# Altium schematic sheet LCL_1.SchDoc
size A4; SheetNumber: 2; SheetTotal: 5
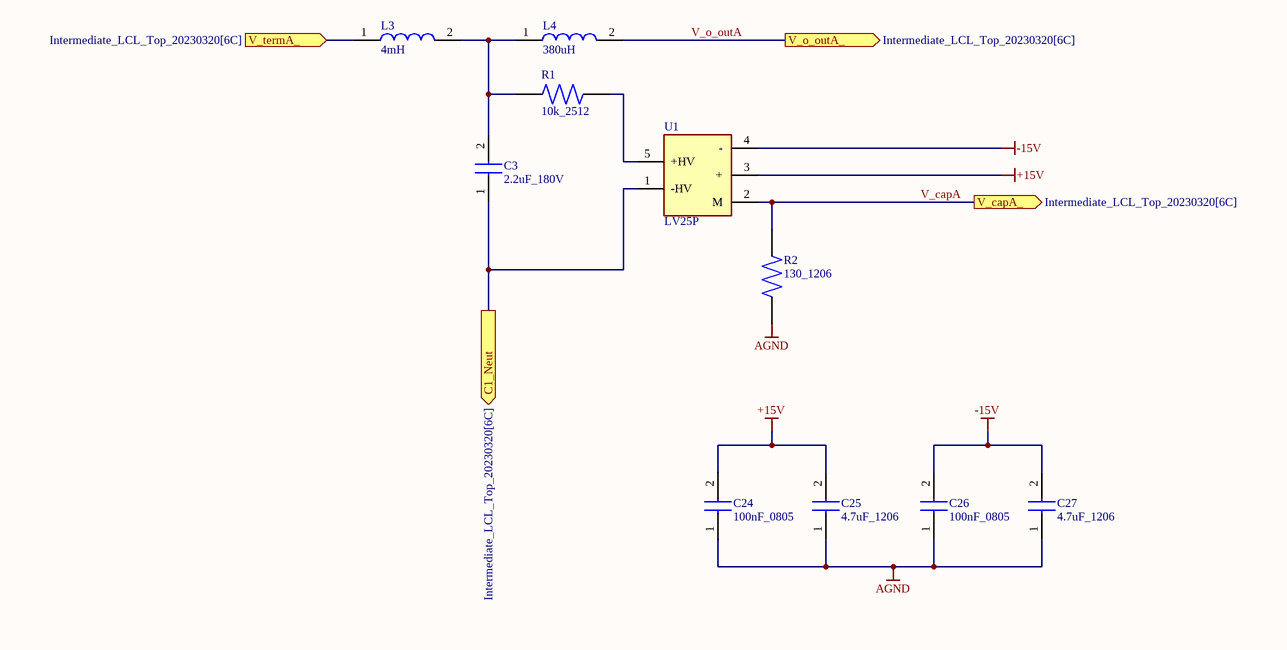
[diagram p0: LCL_1.SchDoc]

## Parts
C3  2.2uF_180V  [Film Capacitor PHE450HF7220JR06L2]
C24  100nF_0805  [0805 Capacitor]
C25  4.7uF_1206  [1206 Capacitor]
C26  100nF_0805  [0805 Capacitor]
C27  4.7uF_1206  [1206 Capacitor]
L3  4mH  [4mH Custom]
L4  380uH  [380uH Custom]
R1  10k_2512  [2512 Resistor]
R2  130_1206  [1206 Resistor]
U1  LV25P  [LV-25-P]

## Ports
C1_Neut (out, see Intermediate_LCL_Top_20230320[6C]), V_capA_ (out, see Intermediate_LCL_Top_20230320[6C]), V_o_outA_ (out, see Intermediate_LCL_Top_20230320[6C]), V_termA_ (in, see Intermediate_LCL_Top_20230320[6C])

## Nets
+15V: C24.2 C25.2 U1.3(+)
-15V: C26.2 C27.2 U1.4(-)
AGND: C24.1 C25.1 C26.1 C27.1 R2.1
C1_Neut: C3.1 U1.1(-HV) ; port C1_Neut
V_capA: R2.2 U1.2(M) ; port V_capA_
V_o_outA: L4.2 ; port V_o_outA_
V_termA_: L3.1 ; port V_termA_
NetC3_2: C3.2 L3.2 L4.1 R1.1
NetR1_2: R1.2 U1.5(+HV)

## Library data of the parts
C3 = PHE450HF7220JR06L2: KEMET PHE450 Metallised Polypropylene Film Capacitor, 180 V ac, 250 V dc, ±5%, 2.2μF, Through Hole; Datasheet Link: https://docs.rs-online.com/a458/0900766b817170df.pdf; Height: 24.5mm; Manufacturer_Name: KEMET; Manufacturer_Part_Number: PHE450HF7220JR06L2
C24 C26 = C0805C104J5RACTU: SMD Multilayer Ceramic Capacitor, 0.1 µF, 50 V, 0805 [2012 Metric], ± 5%, X7R, C Series KEMET
C25 C27 = C3216X7R1H475K160AC: SMD Multilayer Ceramic Capacitor, 4.7 µF, 50 V, 1206 [3216 Metric], ± 10%, X7R, C; MP: C1206C120J5GACTU; Package: None; Price: None; Value: *; Availability: Unavailable
L3 = 4mH Custom Inductor
L4 = 380uH Custom Inductor
R1 = MCHP122WF1002T4E: SMD Chip Resistor, 10 kohm, ± 1%, 2 W, 2512 [6432 Metric], Thick Film, High Power; MF: Bourns; MP: CRE2512-FZ-R007E-3; Mouser-Purchase-URL: https://snapeda.com/shop?store=Mouser&id=836123; Price: None; Package: 6432 Stackpole; Value: *; SnapEDA_Link: https://www.snapeda.com/parts/CRE2512-FZ-R007E-3/Bourns/view-part/836123/?ref=snap; DigiKey-Purchase-URL: https://snapeda.com/shop?store=DigiKey&id=836123; Availability: Good
R2 = CRCW1206130RFKEA: SMD Chip Resistor, 130 ohm, ± 1%, 250 mW, 1206 [3216 Metric], Thick Film, General Purpose; MF: Bourns; MP: CRE2512-FZ-R007E-3; Mouser-Purchase-URL: https://snapeda.com/shop?store=Mouser&id=836123; Price: None; Package: 6432 Stackpole; Value: *; SnapEDA_Link: https://www.snapeda.com/parts/CRE2512-FZ-R007E-3/Bourns/view-part/836123/?ref=snap; DigiKey-Purchase-URL: https://snapeda.com/shop?store=DigiKey&id=836123; Availability: Good
U1 = LV25P: Undefined or Miscellaneous; Manufacturer_Name: LEM; Manufacturer_Part_Number: LV25P